# Altium schematic sheet TestingChargeController.SchDoc: HIGH VOLTAGE BUCK/BOOST MULTI-CHEMISTRY BATTERY CHARGER
size 513 x 386 mm; Date: 09-07-21; SheetNumber: 7; SheetTotal: 8; SKU#(-P): DCXXXXA-P; PCA BOM(-I): 700-DCXXXXA-I_REV01; SKU#(-D): DCXXXXA-D; SKU#(-Q): DCXXXXA-Q; SKU#(-V): DCXXXXA-V; SKU#(-F): DCXXXXA-F; SKU#(-O): DCXXXXA-O; PCA BOM(-K): 700-DCXXXXA-K_REV01; SKU#(-M): DCXXXXA-M; PCA BOM(-Y): 700-DCXXXXA-Y_REV01; PCA BOM(-Z): 700-DCXXXXA-Z_REV01; SKU#(-Y): DCXXXXA-Y; PCA BOM: 700-DC2044B_REV01; RevCode: 01; PCA BOM(-E): 700-DCXXXXA-E_REV01; SKU#: DC2044B; PCA BOM(-S): 700-DCXXXXA-S_REV01; Page Number: 1; SKU#(-E): DCXXXXA-E; SKU#(-X): DCXXXXA-X; Page Count: 1; SKU#(-G): DCXXXXA-G; PCA BOM(-W): 700-DCXXXXA-W_REV01; SKU#(-T): DCXXXXA-T; PCA BOM(-T): 700-DCXXXXA-L_REV01; SIZE: N/A; SKU#(-H): DCXXXXA-H; PCA BOM(-N): 700-DCXXXXA-N_REV01; SKU#(-K): DCXXXXA-K; SKU#(-L): DCXXXXA-L; PCA BOM(-U): 700-DCXXXXA-U_REV01; PCA BOM(-O): 700-DCXXXXA-O_REV01; IC NO.: LTC4020; SKU#(-W): DCXXXXA-W; SKU#(-R): DCXXXXA-R; PCA BOM(-Q): 700-DCXXXXA-Q_REV01; PCA BOM(-M): 700-DCXXXXA-M_REV01; SKU#(-I): DCXXXXA-I; PCA BOM(-L): 700-DCXXXXA-L_REV01; SKU#(-N): DCXXXXA-N; PCA BOM(-X): 700-DCXXXXA-X_REV01; PCA BOM(-F): 700-DCXXXXA-F_REV01; PCA BOM(-G): 700-DCXXXXA-G_REV01; PCA BOM(-V): 700-DCXXXXA-V_REV01; PCA BOM(-P): 700-DCXXXXA-P_REV01; SKU#(-Z): DCXXXXA-Z; PCA SCHEMATIC: 710-DC2044B_REV01; PCA BOM(-R): 700-DCXXXXA-R_REV01; SKU#(-J): DCXXXXA-J; PCA BOM(-J): 700-DCXXXXA-J_REV01; PCA BOM(-D): 700-DCXXXXA-D_REV01; PCB DESIGNER: NC; Variant Name: <Variant Name>; PCA ASS'Y DWG: 705-DC2044B_REV01; APP. ENG.: WAT; PCA BOM(-H): 700-DCXXXXA-H_REV01; SKU#(-S): DCXXXXA-S; SKU#(-U): DCXXXXA-U; DsnPath: C:\Users\temp\Documents\WPI\MQP\dc2044b\710-DC2044B_REV01_PCA_SCHEMATIC.DSN; SchematicName: SCHEMATIC1; PageName: PAGE1; PageSize: C; TopSchematic: True
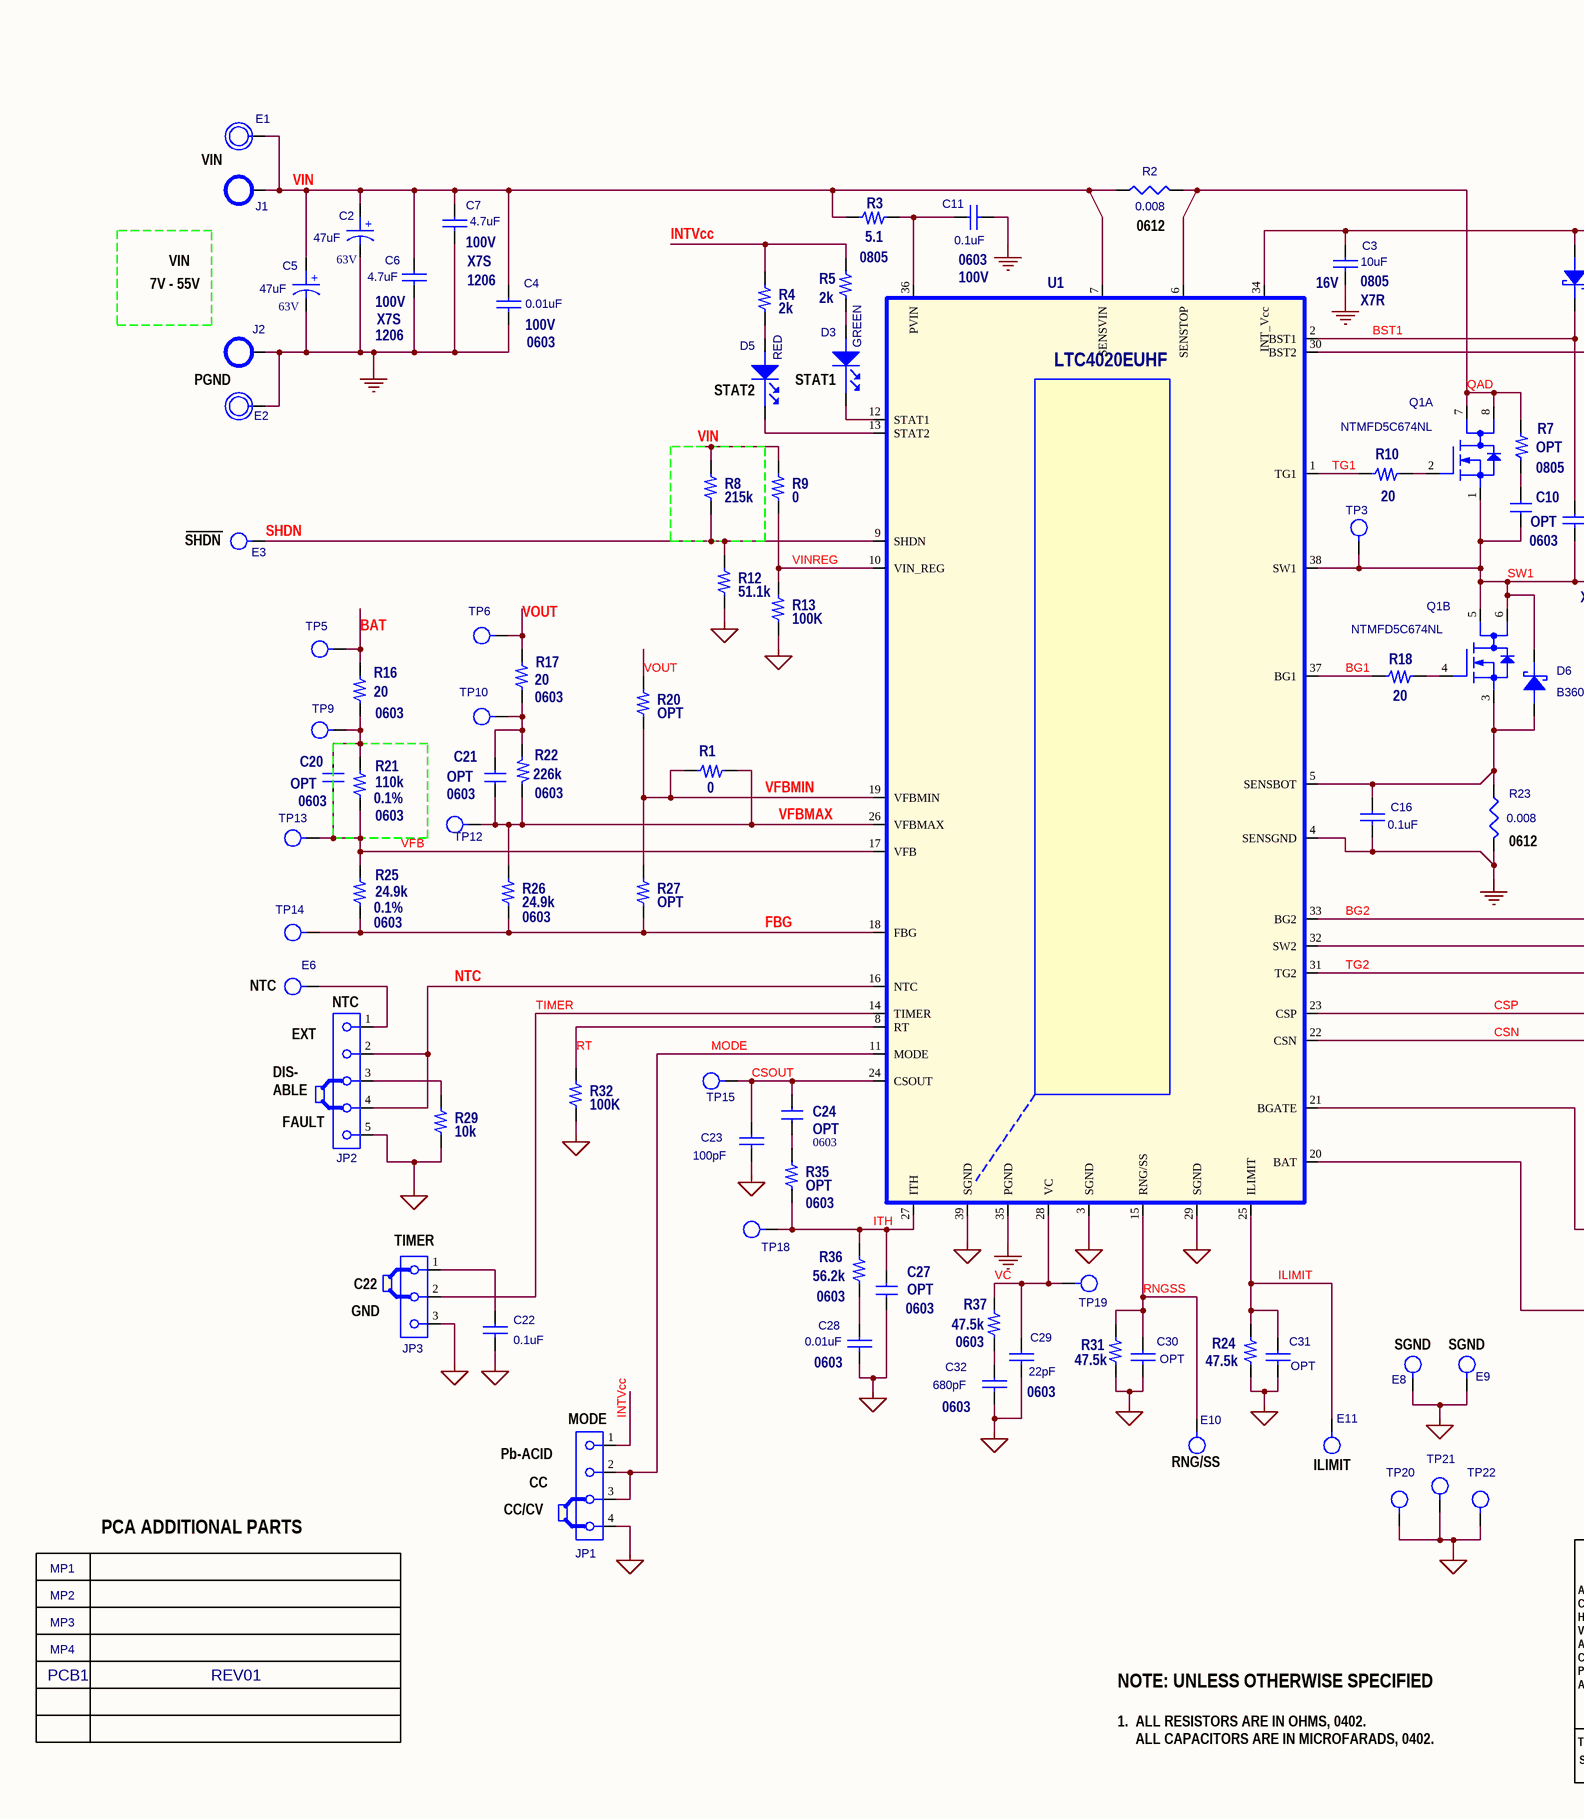
[diagram p0: TestingChargeController.SchDoc, left]
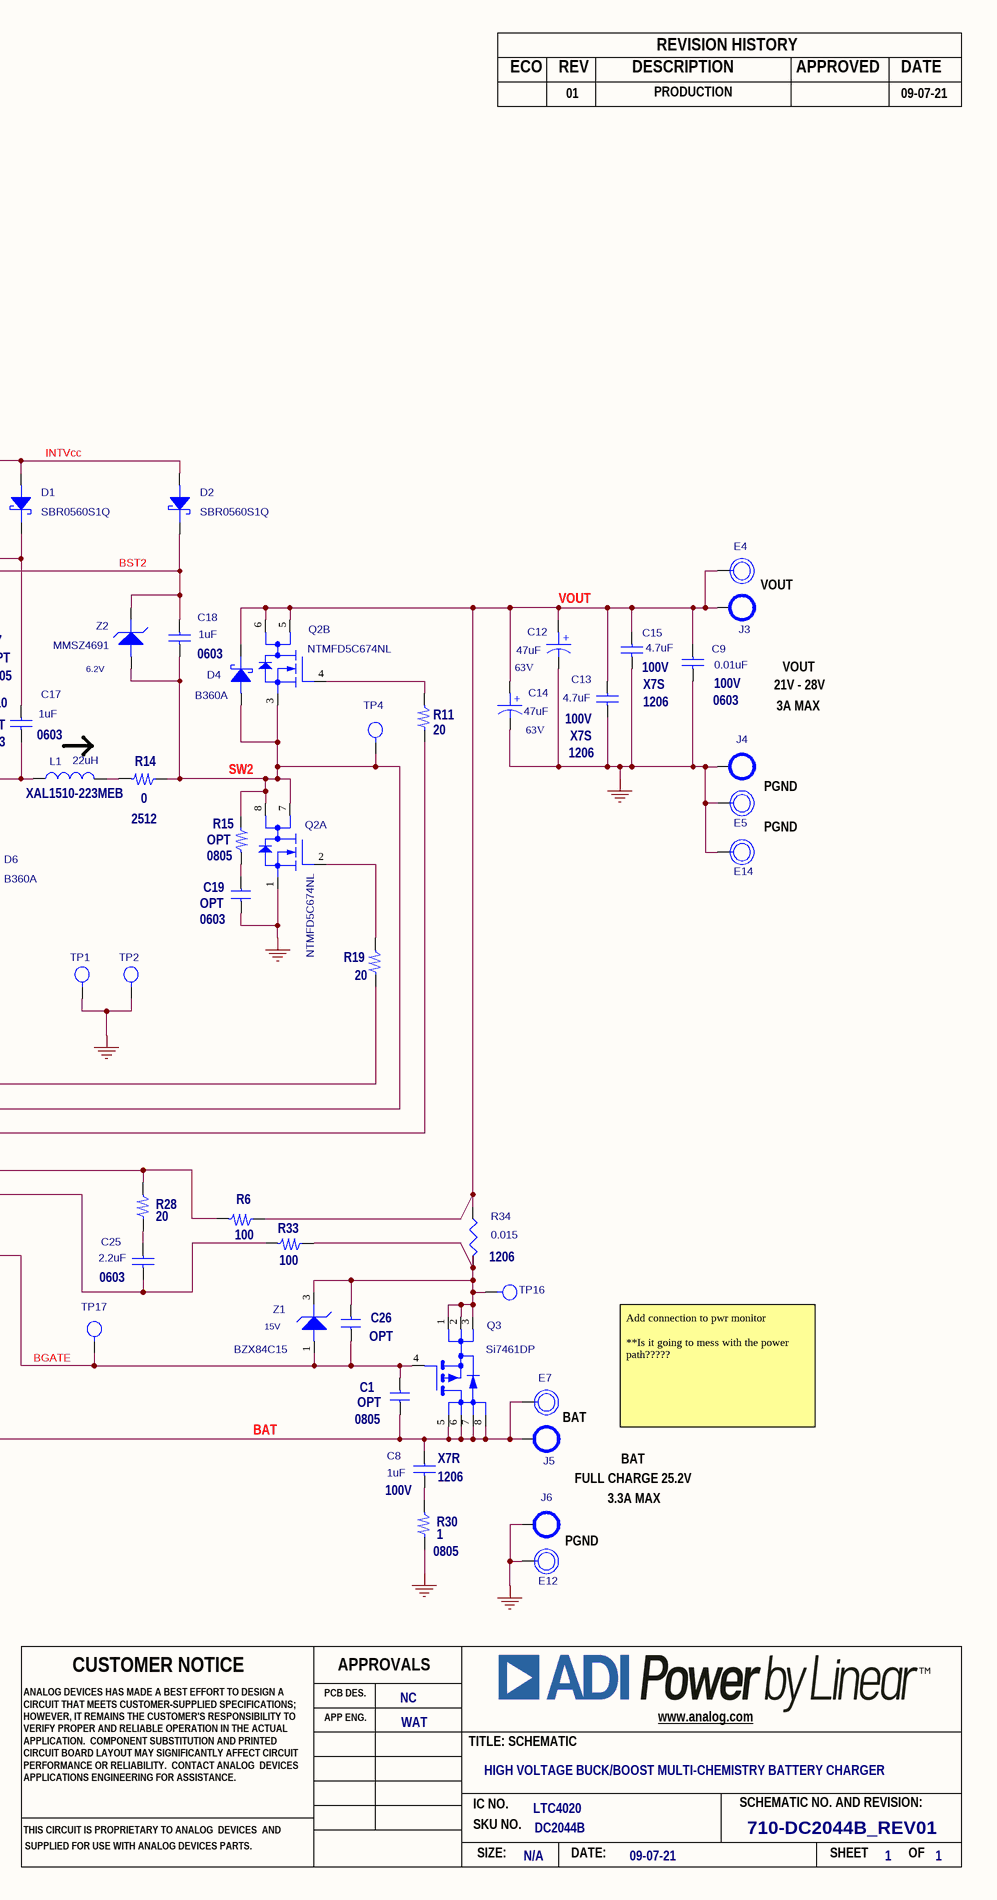
[diagram p1: TestingChargeController.SchDoc, right]

## Parts
*  SKU#: DC2044B  Page Number: 1  PCB DESIGNER: NC  PCA SCHEMATIC: 710-DC2044B_REV01  IC NO.: LTC4020  DATE: 09-07-21  APP. ENG.: WAT  Title: HIGH VOLTAGE BUCK/BOOST MULTI-CHEMISTRY BATTERY CHARGER  (graphical)
C1  OPT  Package Size: 0805  [CC0805N]
C2  47uF  Rated Voltage: 63V  [PANASONIC_ZA_8X10.2]
C3  10uF  Rated Voltage: 16V  Dielectric Type: X7R  Package Size: 0805  [CC0805N]
C4  0.01uF  Rated Voltage: 100V  Package Size: 0603  [CC0603N]
C5  47uF  Rated Voltage: 63V  [PANASONIC_ZA_8X10.2]
C6  4.7uF  Package Size: 1206  Dielectric Type: X7S  Rated Voltage: 100V  [CC1206N]
C7  4.7uF  Package Size: 1206  Dielectric Type: X7S  Rated Voltage: 100V  [CC1206N]
C8  1uF  Rated Voltage: 100V  Temperature Coefficient: X7R  Package Size: 1206  [CC1206N]
C9  0.01uF  Rated Voltage: 100V  Package Size: 0603  [CC0603N]
C10  OPT  Package Size: 0603  [CC0603N]
C11  0.1uF  Rated Voltage: 100V  Package Size: 0603  [CC0603N]
C12  47uF  Rated Voltage: 63V  [PANASONIC_ZA_8X10.2]
C13  4.7uF  Rated Voltage: 100V  Dielectric Type: X7S  Package Size: 1206  [CC1206N]
C14  47uF  Rated Voltage: 63V  [PANASONIC_ZA_8X10.2]
C15  4.7uF  Package Size: 1206  Dielectric Type: X7S  Rated Voltage: 100V  [CC1206N]
C16  0.1uF  [CC0402N]
C17  1uF  Package Size: 0603  [CC0603N]
C18  1uF  Package Size: 0603  [CC0603N]
C19  OPT  Package Size: 0603  [CC0603N]
C20  OPT  Package Size: 0603  [CC0603N]
C21  OPT  Package Size: 0603  [CC0603N]
C22  0.1uF  [CC0402N]
C23  100pF  [CC0402N]
C24  OPT  Package Size: 0603  [CC0603N]
C25  2.2uF  Package Size: 0603  [CC0603N]
C26  OPT  [CC0603N]
C27  OPT  Package Size: 0603  [CC0603N]
C28  0.01uF  Package Size: 0603  [CC0603N]
C29  22pF  Package Size: 0603  [CC0603N]
C30  OPT  [CC0402N]
C31  OPT  [CC0402N]
C32  680pF  Package Size: 0603  [CC0603N]
D1  SBR0560S1Q  [SOD-123N]
D2  SBR0560S1Q  [SOD-123N]
D3  GREEN  [LED_0603]
D4  B360A  [SMA-N]
D5  RED  [LED_0603]
D6  B360A  [SMA-N]
E1  TEST POINT  [MILLMAX2501]  (value not drawn)
E2  TEST POINT  [MILLMAX2501]  (value not drawn)
E3  TEST POINT  [MILLMAX2308]  (value not drawn)
E4  TEST POINT  [MILLMAX2501]  (value not drawn)
E5  TEST POINT  [MILLMAX2501]  (value not drawn)
E6  TEST POINT  [MILLMAX2308]  (value not drawn)
E7  TEST POINT  [MILLMAX2501]  (value not drawn)
E8  TEST POINT  [MILLMAX2308]  (value not drawn)
E9  TEST POINT  [MILLMAX2308]  (value not drawn)
E10  TEST POINT  [MILLMAX2308]  (value not drawn)
E11  TEST POINT  [MILLMAX2308]  (value not drawn)
E12  TEST POINT  [MILLMAX2501]  (value not drawn)
E14  TEST POINT  [MILLMAX2501]  (value not drawn)
J1  BANANA JACK  [KEY-575-4]  (value not drawn)
J2  BANANA JACK  [KEY-575-4]  (value not drawn)
J3  BANANA JACK  [KEY-575-4]  (value not drawn)
J4  BANANA JACK  [KEY-575-4]  (value not drawn)
J5  BANANA JACK  [KEY-575-4]  (value not drawn)
J6  BANANA JACK  [KEY-575-4]  (value not drawn)
JP1  HDR  [HD1X4-079]  (value not drawn)
JP2  HEADER  [HD1X5-079]  (value not drawn)
JP3  HDR  [HD1X3-079]  (value not drawn)
L1  22uH  Manufacturer PN: XAL1510-223MEB  [COILCRAFT-XAL1510]
MP1  STANDOFF  [MTG-8831]  (value not drawn)
MP2  STANDOFF  [MTG-8831]  (value not drawn)
MP3  STANDOFF  [MTG-8831]  (value not drawn)
MP4  STANDOFF  [MTG-8831]  (value not drawn)
PCB1  BOM Notes: REV01  (hidden comment: PCB, DC2044B)
Q1  NTMFD5C674NL  [ONSEMI-DFN8-SO-8FL]  (parts A,B of 2)
Q2  NTMFD5C674NL  [ONSEMI-DFN8-SO-8FL]  (parts A,B of 2)
Q3  Si7461DP  [VISHAY_PPAK_SO-8]
R1  0  [CR0402N]
R2  0.008  [SUSUMU-PRL1632]
R3  5.1  Package Size: 0805  [CR0805N]
R4  2k  [CR0402N]
R5  2k  [CR0402N]
R6  100  [CR0402N]
R7  OPT  Package Size: 0805  [CR0805M]
R8  215k  [CR0402N]
R9  0  [CR0402N]
R10  20  [CR0402N]
R11  20  [CR0402N]
R12  51.1k  [CR0402N]
R13  100K  [CR0402N]
R14  0  Package Size: 2512  [VISHAY-WSL_9-2512]
R15  OPT  Package Size: 0805  [CR0805M]
R16  20  Package Size: 0603  [CR0603N]
R17  20  Package Size: 0603  [CR0603N]
R18  20  [CR0402N]
R19  20  [CR0402N]
R20  OPT  [CR0402N]
R21  110k  Package Size: 0603  Tolerance: 0.1%  [CR0603N]
R22  226k  Package Size: 0603  [CR0603N]
R23  0.008  [SUSUMU-PRL1632]
R24  47.5k  [CR0402N]
R25  24.9k  Package Size: 0603  Tolerance: 0.1%  [CR0603N]
R26  24.9k  Package Size: 0603  [CR0603N]
R27  OPT  [CR0402N]
R28  20  [CR0402N]
R29  10k  [CR0402N]
R30  1  Package Size: 0805  [CR0805M]
R31  47.5k  [CR0402N]
R32  100K  [CR0402N]
R33  100  [CR0402N]
R34  0.015  Package Size: 1206  [SUSUMU-KRL1632]
R35  OPT  Package Size: 0603  [CR0603N]
R36  56.2k  Package Size: 0603  [CR0603N]
R37  47.5k  Package Size: 0603  [CR0603N]
TP1  TEST PAD  [PADSTYLE1]  (value not drawn)
TP2  TEST PAD  [PADSTYLE1]  (value not drawn)
TP3  TEST PAD  [PADSTYLE1]  (value not drawn)
TP4  TEST PAD  [PADSTYLE1]  (value not drawn)
TP5  TEST PAD  [PADSTYLE1]  (value not drawn)
TP6  TEST PAD  [PADSTYLE1]  (value not drawn)
TP9  TEST PAD  [PADSTYLE1]  (value not drawn)
TP10  TEST PAD  [PADSTYLE1]  (value not drawn)
TP12  TEST PAD  [PADSTYLE1]  (value not drawn)
TP13  TEST PAD  [PADSTYLE1]  (value not drawn)
TP14  TEST PAD  [PADSTYLE1]  (value not drawn)
TP15  TEST PAD  [PADSTYLE1]  (value not drawn)
TP16  TEST PAD  [PADSTYLE1]  (value not drawn)
TP17  TEST PAD  [PADSTYLE1]  (value not drawn)
TP18  TEST PAD  [PADSTYLE1]  (value not drawn)
TP19  TEST PAD  [PADSTYLE1]  (value not drawn)
TP20  TEST PAD  [PADSTYLE1]  (value not drawn)
TP21  TEST PAD  [PADSTYLE1]  (value not drawn)
TP22  TEST PAD  [PADSTYLE1]  (value not drawn)
U1  LTC4020EUHF  [LTC-QFN-38-1701]
XJP1  SHUNT  [SAMTEC-SHUNT-079]  (value not drawn)
XJP2  SHUNT  [SAMTEC-SHUNT-079]  (value not drawn)
XJP3  SHUNT  [SAMTEC-SHUNT-079]  (value not drawn)
Z1  BZX84C15  Rated Voltage or Zener Voltage: 15V  [SOT23-3N]
Z2  MMSZ4691  Rated Voltage or Zener Voltage: 6.2V  [SOD-123N]

## Nets
GND_POWER: C2.2 C3.2 C4.2 C5.2 C6.2 C7.2 C9.2 C11.2 C12.2 C13.2 C14.2 C15.2 C16.2 C19.1 E2.1 E5.1 E12.1 E14.1 J2.1 J4.1 J6.1 Q2.1(S1) R23.2 R30.2 TP1.1 TP2.1 U1.4(SENSGND) U1.35(PGND)
GND_SIGNAL: C22.2 C23.2 C27.2 C28.2 C29.2 C30.2 C31.2 C32.2 E8.1(A) E9.1(A) JP1.4 JP2.5 JP3.3 R12.2 R13.2 R24.2 R29.2 R31.2 R32.2 TP20.1 TP21.1 TP22.1 U1.3(SGND) U1.29(SGND) U1.39(SGND)
BAT: C1.2 C8.1 E7.1 J5.1 Q3.5(D_5) Q3.6(D_6) Q3.7(D_7) Q3.8(D_8) R16.1 TP5.1 U1.20(BAT)
BG1: R18.1 U1.37(BG1)
BG2: R19.2 U1.33(BG2)
BGATE: C1.1 C26.2 Q3.4(G) TP17.1 U1.21(BGATE) Z1.1(A)
BST1: C17.1 D1.1(C) U1.2(BST1)
BST2: C18.1 D2.1(C) U1.30(BST2) Z2.1(C)
CSN: C25.2 R33.1 U1.22(CSN)
CSOUT: C23.1 C24.1 TP15.1 U1.24(CSOUT)
CSP: R6.1 R28.1 U1.23(CSP)
FBG: R25.2 R26.2 R27.2 TP14.1 U1.18(FBG)
ILIMIT: C31.1 E11.1(A) R24.1 U1.25(ILIMIT)
INTVcc: C3.1 D1.2(A) D2.2(A) JP1.1 R4.1 R5.1 U1.34(INT_Vcc)
ITH: C27.1 R35.2 R36.1 TP18.1 U1.27(ITH)
MODE: JP1.2 JP1.3 U1.11(MODE)
NTC: JP2.2 JP2.4 U1.16(NTC)
QAD: Q1.7(D1_7) Q1.8(D1_8) R2.2 R7.2 U1.6(SENSTOP)
RNGSS: C30.1 E10.1(A) R31.1 U1.15(RNG/SS)
RT: R32.1 U1.8(RT)
SHDN: E3.1(A) R8.2 R12.1 U1.9(SHDN)
SW1: C10.1 C17.2 D6.1(C) L1.1 Q1.1(S1) Q1.5(D2_5) Q1.6(D2_6) TP3.1 U1.38(SW1)
SW2: C18.2 D4.2(A) Q2.3(S2) Q2.7(D1_7) Q2.8(D1_8) R14.2 R15.2 TP4.1 U1.32(SW2) Z2.2(A)
TG1: R10.1 U1.1(TG1)
TG2: R11.2 U1.31(TG2)
TIMER: JP3.2 U1.14(TIMER)
VC: C29.1 R37.1 TP19.1 U1.28(VC)
VFB: C20.2 R21.2 R25.1 TP13.1 U1.17(VFB)
VFBMAX: C21.2 R1.2 R22.2 R26.1 TP12.1 U1.26(VFBMAX)
VFBMIN: R1.1 R20.2 R27.1 U1.19(VFBMIN)
VIN: C2.1 C4.1 C5.1 C6.1 C7.1 E1.1 J1.1 R2.1 R3.1 R8.1 R9.1 U1.7(SENSVIN)
VINREG: R9.2 R13.1 U1.10(VIN_REG)
VOUT: C9.1 C12.1 C13.1 C14.1 C15.1 D4.1(C) E4.1 J3.1 Q2.5(D2_5) Q2.6(D2_6) R6.2 R17.1 R20.1 R34.1 TP6.1
NetC8_2: C8.2 R30.1
NetC10_2: C10.2 R7.1
NetC11_1: C11.1 R3.2 U1.36(PVIN)
NetC16_1: C16.1 D6.2(A) Q1.3(S2) R23.1 U1.5(SENSBOT)
NetC19_2: C19.2 R15.1
NetC20_1: C20.1 R16.2 R21.1 TP9.1
NetC21_1: C21.1 R17.2 R22.1 TP10.1
NetC22_1: C22.1 JP3.1
NetC24_2: C24.2 R35.1
NetC25_1: C25.1 R28.2
NetC26_1: C26.1 Q3.1(S_1) Q3.2(S_2) Q3.3(S_3) R33.2 R34.2 TP16.1 Z1.3(C)
NetC28_1: C28.1 R36.2
NetC32_1: C32.1 R37.2
NetD3_1: D3.1(CATHODE) U1.12(STAT1)
NetD3_2: D3.2(ANODE) R5.2
NetD5_1: D5.1(CATHODE) U1.13(STAT2)
NetD5_2: D5.2(ANODE) R4.2
NetE6_1: E6.1(A) JP2.1
NetJP2_3: JP2.3 R29.1
NetL1_2: L1.2 R14.1
NetQ1_2: Q1.2(G1) R10.2
NetQ1_4: Q1.4(G2) R18.2
NetQ2_2: Q2.2(G1) R19.1
NetQ2_4: Q2.4(G2) R11.1

## Notes on the sheet
- REVISION HISTORY
- ECO
- REV
- 01
- DESCRIPTION
- PRODUCTION
- APPROVED
- DATE
- 09-07-21
- VIN
- (near R2) 0612
- 7V - 55V
- PGND
- (near D5) STAT2
- (near D3) STAT1
- VOUT
- 21V - 28V
- 3A MAX
- (near E3) SHDN
- (near R23) 0612
- (near E6) NTC
- NTC
- (near XJP2) EXT
- (near XJP2) DIS-
  ABLE
- FAULT
- TIMER
- GND
- (near XJP3) C22
- (near E8) SGND
- (near E9) SGND
- BAT
- Add connection to pwr monitor
  **Is it going to mess with the power path?????
- FULL CHARGE 25.2V
- 3.3A MAX
- (near XJP1) Pb-ACID
- (near JP1) MODE
- (near E10) RNG/SS
- (near E11) ILIMIT
- PCA ADDITIONAL PARTS
- (near XJP1) CC/CV
- (near XJP1) CC
- NOTE: UNLESS OTHERWISE SPECIFIED
- 1.  ALL RESISTORS ARE IN OHMS, 0402.
  ALL CAPACITORS ARE IN MICROFARADS, 0402.
- (in symbol CAP_P_ALT) +
- (in symbol TITLEBLK_REV09_2) CUSTOMER NOTICE; APPROVALS; PCB DES.; APP ENG.; www.analog.com; TITLE: SCHEMATIC; ANALOG DEVICES HAS MADE A BEST EFFORT TO DESIGN A / CIRCUIT THAT MEETS CUSTOMER-SUPPLIED SPECIFICATIONS; / HOWEVER, IT REMAINS THE CUSTOMER'S RESPONSIBILITY TO / VERIFY PROPER AND RELIABLE OPERATION IN THE ACTUAL / APPLICATION.  COMPONENT SUBSTITUTION AND PRINTED / CIRCUIT BOARD LAYOUT MAY SIGNIFICANTLY AFFECT CIRCUIT / PERFORMANCE OR RELIABILITY.  CONTACT ANALOG  DEVICES / APPLICATIONS ENGINEERING FOR ASSISTANCE.; IC NO.; SCHEMATIC NO. AND REVISION:; THIS CIRCUIT IS PROPRIETARY TO ANALOG  DEVICES  AND; SKU NO.; SUPPLIED FOR USE WITH ANALOG DEVICES PARTS.; SIZE:; DATE:; SHEET; OF

## Library data of the parts
* = TITLEBLK_REV09_2: SKU#(-Z): DCXXXXA-Z; SKU#(-Y): DCXXXXA-Y; SKU#(-X): DCXXXXA-X; SKU#(-W): DCXXXXA-W; SKU#(-V): DCXXXXA-V; SKU#(-U): DCXXXXA-U; SKU#(-T): DCXXXXA-T; SKU#(-S): DCXXXXA-S; SKU#(-R): DCXXXXA-R; SKU#(-Q): DCXXXXA-Q; SKU#(-P): DCXXXXA-P; SKU#(-O): DCXXXXA-O; SKU#(-N): DCXXXXA-N; SKU#(-M): DCXXXXA-M; SKU#(-L): DCXXXXA-L; SKU#(-K): DCXXXXA-K; SKU#(-J): DCXXXXA-J; SKU#(-I): DCXXXXA-I; SKU#(-H): DCXXXXA-H; SKU#(-G): DCXXXXA-G; SKU#(-F): DCXXXXA-F; SKU#(-E): DCXXXXA-E; SKU#(-D): DCXXXXA-D; PCA BOM(-Z): 700-DCXXXXA-Z_REV01; PCA BOM(-Y): 700-DCXXXXA-Y_REV01; PCA BOM(-X): 700-DCXXXXA-X_REV01; PCA BOM(-W): 700-DCXXXXA-W_REV01; PCA BOM(-V): 700-DCXXXXA-V_REV01; PCA BOM(-U): 700-DCXXXXA-U_REV01; PCA BOM(-T): 700-DCXXXXA-L_REV01; PCA BOM(-S): 700-DCXXXXA-S_REV01; PCA BOM(-R): 700-DCXXXXA-R_REV01; PCA BOM(-Q): 700-DCXXXXA-Q_REV01; PCA BOM(-P): 700-DCXXXXA-P_REV01; PCA BOM(-O): 700-DCXXXXA-O_REV01; PCA BOM(-N): 700-DCXXXXA-N_REV01; PCA BOM(-M): 700-DCXXXXA-M_REV01; PCA BOM(-K): 700-DCXXXXA-K_REV01; PCA BOM(-J): 700-DCXXXXA-J_REV01; PCA BOM(-I): 700-DCXXXXA-I_REV01; PCA BOM(-H): 700-DCXXXXA-H_REV01; PCA BOM(-G): 700-DCXXXXA-G_REV01; PCA BOM(-F): 700-DCXXXXA-F_REV01; PCA BOM(-E): 700-DCXXXXA-E_REV01; PCA BOM(-D): 700-DCXXXXA-D_REV01; PCA BOM: 700-DC2044B_REV01; PCA ASS'Y DWG: 705-DC2044B_REV01; RevCode: 01; Variant Name: <Variant Name>; SIZE: N/A; Page Count: 1; PCA BOM(-L): 700-DCXXXXA-L_REV01
C1 = CAP_ALT: CAP., OPTION, 0805; Part Reference: C1; PART_NUMBER: 150-3036; EDMVersionID: 3900555435; CLASS: DISCRETE; Value: OPT; PCB Footprint: CC0805N; Package Type: SMD
C2 = CAP_P_ALT: CAP.,47uF,ALUM ELECT.,63V,20%,SMD,8.0x10.2 mm,AEC-Q200; Part Reference: C2; PART_NUMBER: 150-0969; Manufacturer: PANASONIC; Manufacturer PN: EEHZA1J470P; Inventory Qty: 0; CLASS: DISCRETE; Value: 47uF; PCB Footprint: PANASONIC_ZA_8X10.2; Dielectric Type: ALUM ELECT.; Package Size: SMD,8.0x10.2 mm; Tolerance: 20%
C3 = CAP: CAP.,10uF,X7R,16V,10%,0805; Part Reference: C3; Manufacturer PN: EMK212BB7106MG-T; Manufacturer: TAIYO YUDEN; PART_NUMBER: 150-3231; CLASS: DISCRETE; Inventory Qty: 22441; FPLIST: CC0805N,CC0805L,CC0805M; Value: 10uF; PCB Footprint: CC0805N; Tolerance: 10%; Package Type: SMD
C4 = CAP: CAP.,0.01uF,X7R,100V,10%,0603,AEC-Q200; Part Reference: C4; Manufacturer PN: GCJ188R72A103KA01D; Manufacturer: MURATA; PART_NUMBER: 150-0511; CLASS: DISCRETE; Inventory Qty: 20068; FPLIST: CC0603N,CC0603L,CC0603M; Value: 0.01uF; PCB Footprint: CC0603N; Tolerance: 10%; Dielectric Type: X7R
C5 = CAP_P_ALT: CAP.,47uF,ALUM ELECT.,63V,20%,SMD,8.0x10.2 mm,AEC-Q200; Part Reference: C5; Manufacturer PN: EEHZA1J470P; Manufacturer: PANASONIC; PART_NUMBER: 150-0969; Inventory Qty: 0; CLASS: DISCRETE; Value: 47uF; PCB Footprint: PANASONIC_ZA_8X10.2; Dielectric Type: ALUM ELECT.; Package Size: SMD,8.0x10.2 mm; Tolerance: 20%
C6 = CAP: CAP.,4.7uF,X7S,100V,20%,1206; Part Reference: C6; PART_NUMBER: 150-2278; Manufacturer: AVX; Manufacturer PN: 12061Z475MAT2A; FPLIST: CC1206N,CC1206L,CC1206M; Inventory Qty: 11240; CLASS: DISCRETE; Value: 4.7uF; PCB Footprint: CC1206N; Tolerance: 20%
C7 = CAP: CAP.,4.7uF,X7S,100V,20%,1206; Part Reference: C7; PART_NUMBER: 150-2278; Manufacturer: AVX; Manufacturer PN: 12061Z475MAT2A; FPLIST: CC1206N,CC1206L,CC1206M; Inventory Qty: 11240; CLASS: DISCRETE; Value: 4.7uF; PCB Footprint: CC1206N; Tolerance: 20%
C8 = CAP: CAP.,1uF,X7R,100V,10%,1206,AEC-Q200; Part Reference: C8; Manufacturer PN: CGA5L2X7R2A105K160AA; Manufacturer: TDK; PART_NUMBER: 150-1253; CLASS: DISCRETE; Inventory Qty: 800; FPLIST: CC1206N,CC1206L,CC1206M; Value: 1uF; PCB Footprint: CC1206N; Tolerance: 10%; Dielectric Type: X7R; Package Type: -
C9 = CAP: CAP.,0.01uF,X7R,100V,10%,0603,AEC-Q200; Part Reference: C9; Manufacturer PN: GCJ188R72A103KA01D; Manufacturer: MURATA; PART_NUMBER: 150-0511; CLASS: DISCRETE; Inventory Qty: 20068; FPLIST: CC0603N,CC0603L,CC0603M; Value: 0.01uF; PCB Footprint: CC0603N; Tolerance: 10%; Dielectric Type: X7R
C10 = CAP_ALT: CAP., OPTION, 0603; Part Reference: C10; PART_NUMBER: 150-3038; EDMVersionID: 3900555435; CLASS: DISCRETE; Value: OPT; Package Type: SMD; PCB Footprint: CC0603N
C11 = CAP: CAP.,0.1uF,X7R,100V,10%,0603,AEC-Q200; Part Reference: C11; Manufacturer PN: HMK107B7104KAHT; Manufacturer: TAIYO YUDEN; PART_NUMBER: 150-2623; CLASS: DISCRETE; Inventory Qty: 7960; FPLIST: CC0603N,CC0603L,CC0603M; Value: 0.1uF; PCB Footprint: CC0603N; Tolerance: 10%; Dielectric Type: X7R
C12 = CAP_P_ALT: CAP.,47uF,ALUM ELECT.,63V,20%,SMD,8.0x10.2 mm,AEC-Q200; Part Reference: C12; PART_NUMBER: 150-0969; Manufacturer: PANASONIC; Manufacturer PN: EEHZA1J470P; CLASS: DISCRETE; Inventory Qty: 0; Value: 47uF; PCB Footprint: PANASONIC_ZA_8X10.2; Tolerance: 20%; Package Size: SMD,8.0x10.2 mm; Dielectric Type: ALUM ELECT.
C13 = CAP: CAP.,4.7uF,X7S,100V,20%,1206; Part Reference: C13; Manufacturer PN: 12061Z475MAT2A; Manufacturer: AVX; PART_NUMBER: 150-2278; CLASS: DISCRETE; Inventory Qty: 11240; FPLIST: CC1206N,CC1206L,CC1206M; Value: 4.7uF; PCB Footprint: CC1206N; Tolerance: 20%
C14 = CAP_P_ALT: CAP.,47uF,ALUM ELECT.,63V,20%,SMD,8.0x10.2 mm,AEC-Q200; Part Reference: C14; PART_NUMBER: 150-0969; Manufacturer: PANASONIC; Manufacturer PN: EEHZA1J470P; Inventory Qty: 0; CLASS: DISCRETE; Value: 47uF; PCB Footprint: PANASONIC_ZA_8X10.2; Dielectric Type: ALUM ELECT.; Package Size: SMD,8.0x10.2 mm; Tolerance: 20%
C15 = CAP: CAP.,4.7uF,X7S,100V,20%,1206; Part Reference: C15; PART_NUMBER: 150-2278; Manufacturer: AVX; Manufacturer PN: 12061Z475MAT2A; FPLIST: CC1206N,CC1206L,CC1206M; Inventory Qty: 11240; CLASS: DISCRETE; Value: 4.7uF; PCB Footprint: CC1206N; Tolerance: 20%
C16 = CAP: CAP.,0.1uF,X7R,16V,10%,0402,AEC-Q200; Part Reference: C16; PART_NUMBER: 150-0506; Manufacturer: MURATA; Manufacturer PN: GCM155R71C104KA55D; FPLIST: CC0402N,CC0402L,CC0402M; Inventory Qty: 23025; CLASS: DISCRETE; Value: 0.1uF; PCB Footprint: CC0402N; Package Size: 0402; Dielectric Type: X7R; Tolerance: 10%; Rated Voltage: 16V
C17 = CAP: CAP.,1uF,X7R,16V,10%,0603; Part Reference: C17; Manufacturer PN: C0603C105K4RAC7867; Manufacturer: KEMET; PART_NUMBER: 150-0179; CLASS: DISCRETE; Inventory Qty: 29099; FPLIST: CC0603N,CC0603L,CC0603M; Value: 1uF; PCB Footprint: CC0603N; Rated Voltage: 16V; Tolerance: 10%; Dielectric Type: X7R
C18 = CAP: CAP.,1uF,X7R,16V,10%,0603; Part Reference: C18; Manufacturer PN: C0603C105K4RAC7867; Manufacturer: KEMET; PART_NUMBER: 150-0179; CLASS: DISCRETE; Inventory Qty: 29099; FPLIST: CC0603N,CC0603L,CC0603M; Value: 1uF; PCB Footprint: CC0603N; Rated Voltage: 16V; Tolerance: 10%; Dielectric Type: X7R
C19 = CAP_ALT: CAP., OPTION, 0603; Part Reference: C19; PART_NUMBER: 150-3038; EDMVersionID: 3900555435; CLASS: DISCRETE; Value: OPT; PCB Footprint: CC0603N; Package Type: SMD
C20 = CAP_ALT: CAP., OPTION, 0603; Part Reference: C20; PART_NUMBER: 150-3038; EDMVersionID: 3900555435; CLASS: DISCRETE; Value: OPT; Package Type: SMD; PCB Footprint: CC0603N
C21 = CAP_ALT: CAP., OPTION, 0603; Part Reference: C21; PART_NUMBER: 150-3038; EDMVersionID: 3900555435; CLASS: DISCRETE; Value: OPT; PCB Footprint: CC0603N; Package Type: SMD
C22 = CAP: CAP.,0.1uF,X7R,16V,10%,0402,AEC-Q200; Part Reference: C22; Manufacturer PN: GCM155R71C104KA55D; Manufacturer: MURATA; PART_NUMBER: 150-0506; CLASS: DISCRETE; Inventory Qty: 23025; FPLIST: CC0402N,CC0402L,CC0402M; Value: 0.1uF; Rated Voltage: 16V; Tolerance: 10%; Dielectric Type: X7R; Package Size: 0402; PCB Footprint: CC0402N
C23 = CAP: CAP.,100pF,C0G,50V,5%,0402; Part Reference: C23; PART_NUMBER: 150-0115; Manufacturer: AVX; Manufacturer PN: 04025A101JAT2A; FPLIST: CC0402N,CC0402L,CC0402M; Inventory Qty: 62393; CLASS: DISCRETE; Value: 100pF; PCB Footprint: CC0402N; Package Size: 0402; Dielectric Type: C0G; Tolerance: 5%; Rated Voltage: 50V
C24 = CAP_ALT: CAP., OPTION, 0603; Part Reference: C24; PART_NUMBER: 150-3038; EDMVersionID: 3900555435; CLASS: DISCRETE; Value: OPT; Package Type: SMD; PCB Footprint: CC0603N
C25 = CAP: CAP.,2.2uF,X7R,10V,10%,0603; Part Reference: C25; Manufacturer PN: GRM188R71A225KE15D; Manufacturer: MURATA; PART_NUMBER: 150-2083; CLASS: DISCRETE; Inventory Qty: 13521; FPLIST: CC0603N,CC0603L,CC0603M; Value: 2.2uF; Rated Voltage: 10V; Tolerance: 10%; Dielectric Type: X7R; PCB Footprint: CC0603N
C26 = CAP_ALT: CAP., OPTION, 0603; Part Reference: C26; PART_NUMBER: 150-3038; EDMVersionID: 3900555435; CLASS: DISCRETE; Value: OPT; PCB Footprint: CC0603N; Package Type: SMD; Package Size: 0603
C27 = CAP_ALT: CAP., OPTION, 0603; Part Reference: C27; PART_NUMBER: 150-3038; EDMVersionID: 3900555435; CLASS: DISCRETE; Value: OPT; Package Type: SMD; PCB Footprint: CC0603N
C28 = CAP: CAP.,0.01uF,X7R,50V,10%,0603; Part Reference: C28; Manufacturer PN: 06035C103KAT2A; Manufacturer: AVX; PART_NUMBER: 150-0002; CLASS: DISCRETE; Inventory Qty: 28283; FPLIST: CC0603N,CC0603L,CC0603M; Value: 0.01uF; PCB Footprint: CC0603N; Rated Voltage: 50V; Tolerance: 10%; Dielectric Type: X7R
C29 = CAP: CAP.,22pF,C0G,25V,10%,0603; Part Reference: C29; Manufacturer PN: 06033A220KAT2A; Manufacturer: AVX; PART_NUMBER: 150-3274; CLASS: DISCRETE; Inventory Qty: 12404; FPLIST: CC0603N,CC0603L,CC0603M; Value: 22pF; PCB Footprint: CC0603N; Rated Voltage: 25V; Tolerance: 10%; Dielectric Type: C0G
C30 = CAP: CAP., OPTION, 0402; Part Reference: C30; PART_NUMBER: 150-3148; CLASS: DISCRETE; FPLIST: CC0402N,CC0402L,CC0402M; Value: OPT; PCB Footprint: CC0402N; Package Type: SMD; Package Size: 0402
C31 = CAP: CAP., OPTION, 0402; Part Reference: C31; PART_NUMBER: 150-3148; CLASS: DISCRETE; FPLIST: CC0402N,CC0402L,CC0402M; Value: OPT; PCB Footprint: CC0402N; Package Type: SMD; Package Size: 0402
C32 = CAP: CAP.,680pF,C0G,25V,5%,0603; Part Reference: C32; Manufacturer PN: 06033A681JAT2A; Manufacturer: AVX; PART_NUMBER: 150-0275; CLASS: DISCRETE; Inventory Qty: 8685; FPLIST: CC0603N,CC0603L,CC0603M; Value: 680pF; PCB Footprint: CC0603N; Rated Voltage: 25V; Tolerance: 5%; Dielectric Type: C0G
D1 = DIODE_SCHOTTKY_A_ALT: DIODE,SBR,60V,500mA,SOD123; Part Reference: D1; PART_NUMBER: 210-0561; Manufacturer: DIODES INC.; Manufacturer PN: SBR0560S1Q-7; Inventory Qty: 0; CLASS: DISCRETE; Value: SBR0560S1Q; PCB Footprint: SOD-123N; Package Size: SOD-123; Package Type: SOD123; Rated Voltage or Zener Voltage: 60V
D2 = DIODE_SCHOTTKY_A_ALT: DIODE,SBR,60V,500mA,SOD123; Part Reference: D2; PART_NUMBER: 210-0561; Manufacturer: DIODES INC.; Manufacturer PN: SBR0560S1Q-7; Inventory Qty: 0; CLASS: DISCRETE; Value: SBR0560S1Q; PCB Footprint: SOD-123N; Package Size: SOD-123; Package Type: SOD123; Rated Voltage or Zener Voltage: 60V
D3 = LED_ALT: LED,GREEN,WATER-CLEAR,0603; Part Reference: D3; PART_NUMBER: 270-0051; Manufacturer: LITE-ON; Manufacturer PN: LTST-C190KGKT; CLASS: DISCRETE; Inventory Qty: 49236; Value: GREEN; Package Type: 0603; PCB Footprint: LED_0603
D4 = DIODE_SCHOTTKY_A_ALT: DIODE,SCHOTTKY RECTIFIER,60V,3A,4.6mm X 2.92mm; Part Reference: D4; Manufacturer PN: B360A-13-F; Manufacturer: DIODES INC.; PART_NUMBER: 210-0103; CLASS: DISCRETE; Inventory Qty: 1450; FPLIST: SMA-N,SMA-L,SMA-M,SMA; Value: B360A; PCB Footprint: SMA-N; Max Forward Current or Rated Power: 3A; Rated Voltage or Zener Voltage: 60V; Package Type: 4.6mm X 2.92mm
D5 = LED_ALT: LED,RED,WATER-CLEAR,0603; Part Reference: D5; Manufacturer PN: LTST-C193KRKT-5A; Manufacturer: LITE-ON; PART_NUMBER: 270-0070; CLASS: DISCRETE; Inventory Qty: 15266; Value: RED; Package Type: 0603; Package Size: 0603 (1608 Metric); PCB Footprint: LED_0603
D6 = DIODE_SCHOTTKY_A_ALT: DIODE,SCHOTTKY RECTIFIER,60V,3A,4.6mm X 2.92mm; Part Reference: D6; PART_NUMBER: 210-0103; Manufacturer: DIODES INC.; Manufacturer PN: B360A-13-F; FPLIST: SMA-N,SMA-L,SMA-M,SMA; Inventory Qty: 1450; CLASS: DISCRETE; Value: B360A; PCB Footprint: SMA-N; Package Type: 4.6mm X 2.92mm; Rated Voltage or Zener Voltage: 60V; Max Forward Current or Rated Power: 3A
E1 = TURRET_A: TEST POINT,TURRET,0.094" MTG. HOLE,PCB 0.062" THK; Part Reference: E1; Manufacturer PN: 2501-2-00-80-00-00-07-0; Manufacturer: MILL-MAX; PART_NUMBER: 260-0003; CLASS: IO; Inventory Qty: 823526; Value: TEST POINT; PCB Footprint: MILLMAX2501
E2 = TURRET_A: TEST POINT,TURRET,0.094" MTG. HOLE,PCB 0.062" THK; Part Reference: E2; Manufacturer PN: 2501-2-00-80-00-00-07-0; Manufacturer: MILL-MAX; PART_NUMBER: 260-0003; CLASS: IO; Inventory Qty: 823526; Value: TEST POINT; PCB Footprint: MILLMAX2501
E3 = TEST_POINT_.156_MILL-MAX_2308: TEST POINT,TURRET,0.064" MTG. HOLE,PCB 0.062" THK; Part Reference: E3; PART_NUMBER: 260-0004; Manufacturer PN: 2308-2-00-80-00-00-07-0; Inventory Qty: 1142083; FPLIST: MILLMAX2308,MILLMAX2308-2; CLASS: IO; Value: TEST POINT; Manufacturer: MILL-MAX; PCB Footprint: MILLMAX2308
E4 = TURRET_A: TEST POINT,TURRET,0.094" MTG. HOLE,PCB 0.062" THK; Part Reference: E4; PART_NUMBER: 260-0003; Manufacturer: MILL-MAX; Manufacturer PN: 2501-2-00-80-00-00-07-0; Inventory Qty: 823526; CLASS: IO; Value: TEST POINT; PCB Footprint: MILLMAX2501
E5 = TURRET_A: TEST POINT,TURRET,0.094" MTG. HOLE,PCB 0.062" THK; Part Reference: E5; PART_NUMBER: 260-0003; Manufacturer: MILL-MAX; Manufacturer PN: 2501-2-00-80-00-00-07-0; Inventory Qty: 823526; CLASS: IO; Value: TEST POINT; PCB Footprint: MILLMAX2501
E6 = TEST_POINT_.156_MILL-MAX_2308: TEST POINT,TURRET,0.064" MTG. HOLE,PCB 0.062" THK; Part Reference: E6; PART_NUMBER: 260-0004; Manufacturer PN: 2308-2-00-80-00-00-07-0; Inventory Qty: 1142083; FPLIST: MILLMAX2308,MILLMAX2308-2; CLASS: IO; Value: TEST POINT; PCB Footprint: MILLMAX2308; Manufacturer: MILL-MAX
E7 = TURRET_A: TEST POINT,TURRET,0.094" MTG. HOLE,PCB 0.062" THK; Part Reference: E7; PART_NUMBER: 260-0003; Manufacturer: MILL-MAX; Manufacturer PN: 2501-2-00-80-00-00-07-0; Inventory Qty: 823526; CLASS: IO; Value: TEST POINT; PCB Footprint: MILLMAX2501
E8 = TEST_POINT_.156_MILL-MAX_2308: TEST POINT,TURRET,0.064" MTG. HOLE,PCB 0.062" THK; Part Reference: E8; Manufacturer PN: 2308-2-00-80-00-00-07-0; PART_NUMBER: 260-0004; CLASS: IO; FPLIST: MILLMAX2308,MILLMAX2308-2; Inventory Qty: 1142083; Value: TEST POINT; PCB Footprint: MILLMAX2308; Manufacturer: MILL-MAX
E9 = TEST_POINT_.156_MILL-MAX_2308: TEST POINT,TURRET,0.064" MTG. HOLE,PCB 0.062" THK; Part Reference: E9; PART_NUMBER: 260-0004; Manufacturer PN: 2308-2-00-80-00-00-07-0; Inventory Qty: 1142083; FPLIST: MILLMAX2308,MILLMAX2308-2; CLASS: IO; Value: TEST POINT; PCB Footprint: MILLMAX2308; Manufacturer: MILL-MAX
E10 = TEST_POINT_.156_MILL-MAX_2308: TEST POINT,TURRET,0.064" MTG. HOLE,PCB 0.062" THK; Part Reference: E10; Manufacturer PN: 2308-2-00-80-00-00-07-0; PART_NUMBER: 260-0004; CLASS: IO; FPLIST: MILLMAX2308,MILLMAX2308-2; Inventory Qty: 1142083; Value: TEST POINT; PCB Footprint: MILLMAX2308; Manufacturer: MILL-MAX
E11 = TEST_POINT_.156_MILL-MAX_2308: TEST POINT,TURRET,0.064" MTG. HOLE,PCB 0.062" THK; Part Reference: E11; PART_NUMBER: 260-0004; Manufacturer PN: 2308-2-00-80-00-00-07-0; Inventory Qty: 1142083; FPLIST: MILLMAX2308,MILLMAX2308-2; CLASS: IO; Value: TEST POINT; PCB Footprint: MILLMAX2308; Manufacturer: MILL-MAX
E12 = TURRET_A: TEST POINT,TURRET,0.094" MTG. HOLE,PCB 0.062" THK; Part Reference: E12; Manufacturer PN: 2501-2-00-80-00-00-07-0; Manufacturer: MILL-MAX; PART_NUMBER: 260-0003; CLASS: IO; Inventory Qty: 823526; Value: TEST POINT; PCB Footprint: MILLMAX2501
E14 = TURRET_A: TEST POINT,TURRET,0.094" MTG. HOLE,PCB 0.062" THK; Part Reference: E14; PART_NUMBER: 260-0003; Manufacturer: MILL-MAX; Manufacturer PN: 2501-2-00-80-00-00-07-0; Inventory Qty: 823526; CLASS: IO; Value: TEST POINT; PCB Footprint: MILLMAX2501
J1 = BANANA_KEYSTONE-575-4_C: CONN.,BANANA JACK,FEMALE,THT,NON-INSULATED,SWAGE,0.218"; Part Reference: J1; Manufacturer PN: 575-4; PART_NUMBER: 250-0428; CLASS: IO; Inventory Qty: 203061; Value: BANANA JACK; PCB Footprint: KEY-575-4; Manufacturer: KEYSTONE
J2 = BANANA_KEYSTONE-575-4_C: CONN.,BANANA JACK,FEMALE,THT,NON-INSULATED,SWAGE,0.218"; Part Reference: J2; PART_NUMBER: 250-0428; Manufacturer PN: 575-4; Inventory Qty: 203061; CLASS: IO; Value: BANANA JACK; PCB Footprint: KEY-575-4; Manufacturer: KEYSTONE
J3 = BANANA_KEYSTONE-575-4_C: CONN.,BANANA JACK,FEMALE,THT,NON-INSULATED,SWAGE,0.218"; Part Reference: J3; PART_NUMBER: 250-0428; Manufacturer PN: 575-4; Inventory Qty: 203061; CLASS: IO; Value: BANANA JACK; Manufacturer: KEYSTONE; PCB Footprint: KEY-575-4
J4 = BANANA_KEYSTONE-575-4_C: CONN.,BANANA JACK,FEMALE,THT,NON-INSULATED,SWAGE,0.218"; Part Reference: J4; Manufacturer PN: 575-4; PART_NUMBER: 250-0428; CLASS: IO; Inventory Qty: 203061; Value: BANANA JACK; PCB Footprint: KEY-575-4; Manufacturer: KEYSTONE
J5 = BANANA_KEYSTONE-575-4_C: CONN.,BANANA JACK,FEMALE,THT,NON-INSULATED,SWAGE,0.218"; Part Reference: J5; PART_NUMBER: 250-0428; Manufacturer PN: 575-4; Inventory Qty: 203061; CLASS: IO; Value: BANANA JACK; Manufacturer: KEYSTONE; PCB Footprint: KEY-575-4
J6 = BANANA_KEYSTONE-575-4_C: CONN.,BANANA JACK,FEMALE,THT,NON-INSULATED,SWAGE,0.218"; Part Reference: J6; Manufacturer PN: 575-4; PART_NUMBER: 250-0428; CLASS: IO; Inventory Qty: 203061; Value: BANANA JACK; Manufacturer: KEYSTONE; PCB Footprint: KEY-575-4
JP1 = HDR1X4: CONN.,HDR,MALE,1x4,2mm,VERT,ST,THT; Part Reference: JP1; Manufacturer PN: NRPN041PAEN-RC; Manufacturer: SULLINS CONNECTOR SOLUTIONS; PART_NUMBER: 250-0431; CLASS: IO; Inventory Qty: 11710; PCB Footprint: HD1X4-079
JP2 = HDR1X5: CONN.,HEADER,MALE,1X5,2mm,ST, THT; Part Reference: JP2; Manufacturer PN: NRPN051PAEN-RC; Manufacturer: SULLINS CONNECTOR SOLUTIONS; PART_NUMBER: 250-0564; Inventory Qty: 950; CLASS: IO; PCB Footprint: HD1X5-079
JP3 = 1X3: CONN.,HDR,MALE,1x3,2mm,VERT,ST,THT,NO SUBS. ALLOWED; Part Reference: JP3; Manufacturer PN: TMM-103-02-L-S; Manufacturer: SAMTEC; PART_NUMBER: 250-0638; Inventory Qty: 7904; CLASS: IO; PCB Footprint: HD1X3-079
L1 = IND_ALT: IND.,22uH,PWR,20%,14A,16mOHMS,16.2x15.2mm,AEC-Q200; Part Reference: L1; Manufacturer: COILCRAFT; PART_NUMBER: 200-0363; CLASS: DISCRETE; Inventory Qty: 0; Value: 22uH; PCB Footprint: COILCRAFT-XAL1510; Tolerance: 20%; Package Size: 16.2x15.2mm
MP1 = BLANK_MECHANICAL_PART: STANDOFF,NYLON,SNAP-ON,0.25" (6.4mm); Part Reference: MP1; Manufacturer PN: 8831; Manufacturer: KEYSTONE; PART_NUMBER: 763-0006; Inventory Qty: 227624; CLASS: DISCRETE; Value: STANDOFF; PCB Footprint: MTG-8831
MP2 = BLANK_MECHANICAL_PART: STANDOFF,NYLON,SNAP-ON,0.25" (6.4mm); Part Reference: MP2; Manufacturer PN: 8831; Manufacturer: KEYSTONE; PART_NUMBER: 763-0006; Inventory Qty: 227624; CLASS: DISCRETE; Value: STANDOFF; PCB Footprint: MTG-8831
MP3 = BLANK_MECHANICAL_PART: STANDOFF,NYLON,SNAP-ON,0.25" (6.4mm); Part Reference: MP3; Manufacturer PN: 8831; Manufacturer: KEYSTONE; PART_NUMBER: 763-0006; Inventory Qty: 227624; CLASS: DISCRETE; Value: STANDOFF; PCB Footprint: MTG-8831
MP4 = BLANK_MECHANICAL_PART: STANDOFF,NYLON,SNAP-ON,0.25" (6.4mm); Part Reference: MP4; Manufacturer PN: 8831; Manufacturer: KEYSTONE; PART_NUMBER: 763-0006; Inventory Qty: 227624; CLASS: DISCRETE; Value: STANDOFF; PCB Footprint: MTG-8831
PCB1 = BLANK_PCB_PART: PART_NUMBER: 600-DC2044B; Part Reference: PCB1; Manufacturer: ADI APPROVED SUPPLIER; Inventory Qty: 0; CLASS: DISCRETE; Value: PCB, DC2044B; Manufacturer PN: 600-DC2044B
Q1 = DUAL_8P_N-CH_TYPE1A: XSTR.,MOSFET,DUAL N-CH,60V,42A,DFN-8 (SO8FL); Part Reference: Q1; PART_NUMBER: 240-0596; Manufacturer: ON Semiconductor; Manufacturer PN: NTMFD5C674NLT1G; EDMVersionID: 1895815957; Inventory Qty: 0; CLASS: DISCRETE; Polarity: N-Channel; Value: NTMFD5C674NL; Rated Voltage: 60V; Package Type: DFN-8 (SO8FL); Package Size: DFN-8; PCB Footprint: ONSEMI-DFN8-SO-8FL
Q2 = DUAL_8P_N-CH_TYPE1A: XSTR.,MOSFET,DUAL N-CH,60V,42A,DFN-8 (SO8FL); Part Reference: Q2; PART_NUMBER: 240-0596; Manufacturer: ON Semiconductor; Manufacturer PN: NTMFD5C674NLT1G; EDMVersionID: 1895815957; CLASS: DISCRETE; Polarity: N-Channel; Inventory Qty: 0; Value: NTMFD5C674NL; PCB Footprint: ONSEMI-DFN8-SO-8FL; Package Type: DFN-8 (SO8FL); Package Size: DFN-8; Rated Voltage: 60V
Q3 = 8P_P-CH_TYPE1A: XSTR.,MOSFET, P-CH,60V,8.6A,PowerPAK SO-8; Part Reference: Q3; Manufacturer PN: Si7461DP-T1-GE3; Manufacturer: VISHAY; PART_NUMBER: 240-0180; CLASS: DISCRETE; Inventory Qty: 1926; Value: Si7461DP; PCB Footprint: VISHAY_PPAK_SO-8; Rated Voltage: 60V; Package Type: PowerPAK SO-8
R1 = RES_ALT: RES.,0 OHM,1/16W,0402; Part Reference: R1; PART_NUMBER: 100-0215; Manufacturer: ROHM; Manufacturer PN: MCR01MZPJ000; EDMVersionID: 1192147344; FPLIST: CR0402N,CR0402L,CR0402M; Inventory Qty: 264417; CLASS: DISCRETE; Value: 0; PCB Footprint: CR0402N; Package Size: 0402; Rated Power: 1/16W
R2 = RES: RES.,0.008 OHMS,1%,1W,1206,LONG-SIDE,SENSE; Part Reference: R2; Manufacturer PN: PRL1632-R008-F-T1; Manufacturer: Susumu; PART_NUMBER: 100-1805; Inventory Qty: 0; CLASS: DISCRETE; Temperature Coefficient: 0/ +350ppm; Value: 0.008; Rated Power: 1W; Tolerance: 1%; Package Size: 1206,LONG-SIDE; PCB Footprint: SUSUMU-PRL1632
R3 = RES_ALT: RES.,5.1 OHMS,5%,1/8W,0805,AEC-Q200; Part Reference: R3; PART_NUMBER: 100-2080; Manufacturer: VISHAY; Manufacturer PN: CRCW08055R10JNEA; EDMVersionID: 1192147344; FPLIST: CR0805N,CR0805L,CR0805M; Temperature Coefficient: +/-200PPM; Inventory Qty: 9698; CLASS: DISCRETE; Value: 5.1; Tolerance: 5%; Rated Power: 1/8W; PCB Footprint: CR0805N
R4 = RES_ALT: RES.,2k OHMS,1%,1/16W,0402,AEC-Q200; Part Reference: R4; Manufacturer PN: CRCW04022K00FKED; Manufacturer: VISHAY; PART_NUMBER: 100-0018; EDMVersionID: 1192147344; CLASS: DISCRETE; Inventory Qty: 54049; Temperature Coefficient: 100ppm/C; FPLIST: CR0402N,CR0402L,CR0402M; Value: 2k; PCB Footprint: CR0402N; Rated Power: 1/16W; Tolerance: 1%; Package Size: 0402
R5 = RES_ALT: RES.,2k OHMS,1%,1/16W,0402,AEC-Q200; Part Reference: R5; PART_NUMBER: 100-0018; Manufacturer: VISHAY; Manufacturer PN: CRCW04022K00FKED; EDMVersionID: 1192147344; FPLIST: CR0402N,CR0402L,CR0402M; Temperature Coefficient: 100ppm/C; Inventory Qty: 54049; CLASS: DISCRETE; Value: 2k; PCB Footprint: CR0402N; Package Size: 0402; Tolerance: 1%; Rated Power: 1/16W
R6 = RES_ALT: RES.,100 OHMS,1%,1/16W,0402,AEC-Q200; Part Reference: R6; Manufacturer PN: RK73H1ETTP1000F; Manufacturer: KOA SPEER; PART_NUMBER: 100-0175; EDMVersionID: 1192147344; CLASS: DISCRETE; Inventory Qty: 89473; Temperature Coefficient: 100ppm/C; FPLIST: CR0402N,CR0402L,CR0402M; Value: 100; Rated Power: 1/16W; Tolerance: 1%; Package Size: 0402; PCB Footprint: CR0402N
R7 = RES_ALT: RES., OPTION, 0805; Part Reference: R7; PART_NUMBER: 100-2558; EDMVersionID: 1192147344; CLASS: DISCRETE; Value: OPT; PCB Footprint: CR0805M
R8 = RES_ALT: RES.,215k OHMS,1%,1/16W,0402,AEC-Q200; Part Reference: R8; Manufacturer PN: NRC04F5113TRF; Manufacturer: NIC; PART_NUMBER: 100-0583; EDMVersionID: 1192147344; CLASS: DISCRETE; Inventory Qty: 20064; Temperature Coefficient: +/-100PPM; FPLIST: CR0402N,CR0402L,CR0402M; Value: 215k; PCB Footprint: CR0402N; Rated Power: 1/16W; Tolerance: 1%; Package Size: 0402
R9 = RES_ALT: RES.,0 OHM,1/16W,0402; Part Reference: R9; Manufacturer PN: MCR01MZPJ000; Manufacturer: ROHM; PART_NUMBER: 100-0215; EDMVersionID: 1192147344; CLASS: DISCRETE; Inventory Qty: 264417; FPLIST: CR0402N,CR0402L,CR0402M; Value: 0; PCB Footprint: CR0402N; Rated Power: 1/16W; Package Size: 0402
R10 = RES_ALT: RES.,20 OHMS,1%,1/16W,0402; Part Reference: R10; Manufacturer PN: CRCW040220R0FKED; Manufacturer: VISHAY; PART_NUMBER: 100-2322; EDMVersionID: 1192147344; CLASS: DISCRETE; Inventory Qty: 8000; Temperature Coefficient: 100ppm/C; FPLIST: CR0402N,CR0402L,CR0402M; Value: 20; Rated Power: 1/16W; Tolerance: 1%; Package Size: 0402; PCB Footprint: CR0402N
R11 = RES_ALT: RES.,20 OHMS,1%,1/16W,0402; Part Reference: R11; Manufacturer PN: CRCW040220R0FKED; Manufacturer: VISHAY; PART_NUMBER: 100-2322; EDMVersionID: 1192147344; CLASS: DISCRETE; Inventory Qty: 8000; Temperature Coefficient: 100ppm/C; FPLIST: CR0402N,CR0402L,CR0402M; Value: 20; PCB Footprint: CR0402N; Rated Power: 1/16W; Tolerance: 1%; Package Size: 0402
R12 = RES_ALT: RES.,51.1k OHMS,1%,1/16W,0402,AEC-Q200; Part Reference: R12; Manufacturer PN: RMCF0402FT51K1; Manufacturer: STACKPOLE ELECTRONICS, INC.; PART_NUMBER: 100-2544; EDMVersionID: 1192147344; CLASS: DISCRETE; Inventory Qty: 20000; Temperature Coefficient: 100ppm/C; FPLIST: CR0402N,CR0402L,CR0402M; Value: 51.1k; PCB Footprint: CR0402N; Rated Power: 1/16W; Tolerance: 1%; Package Size: 0402
R13 = RES_ALT: RES.,100k OHMS,1%,1/16W,0402,AEC-Q200; Part Reference: R13; PART_NUMBER: 100-0601; Manufacturer: NIC; Manufacturer PN: NRC04F1003TRF; EDMVersionID: 1192147344; FPLIST: CR0402N,CR0402L,CR0402M; Temperature Coefficient: 100PPM; Inventory Qty: 92256; CLASS: DISCRETE; Value: 100K; PCB Footprint: CR0402N; Package Size: 0402; Tolerance: 1%; Rated Power: 1/16W
R14 = RES_ALT: RES.,0 OHM,200A,2512,COPPER,SENSE; Part Reference: R14; Manufacturer PN: WSL251200000ZEA9; Manufacturer: VISHAY; PART_NUMBER: 100-0588; EDMVersionID: 1192147344; Temperature Coefficient: +/-3900ppm; CLASS: DISCRETE; Inventory Qty: 7479; FPLIST: CR2512N,CR2512L,CR2512M,VISHAY-WSL2512; Value: 0; PCB Footprint: VISHAY-WSL_9-2512; Rated Power: 200A
R15 = RES_ALT: RES., OPTION, 0805; Part Reference: R15; PART_NUMBER: 100-2558; EDMVersionID: 1192147344; CLASS: DISCRETE; Value: OPT; PCB Footprint: CR0805M
R16 = RES_ALT: RES.,20 OHMS,1%,1/10W,0603; Part Reference: R16; PART_NUMBER: 100-0703; Manufacturer: YAGEO; Manufacturer PN: RC0603FR-0720RL; EDMVersionID: 1192147344; FPLIST: CR0603N,CR0603L,CR0603M; Temperature Coefficient: 100PPM; Inventory Qty: 10000; CLASS: DISCRETE; Value: 20; PCB Footprint: CR0603N; Tolerance: 1%; Rated Power: 1/10W
R17 = RES_ALT: RES.,20 OHMS,1%,1/10W,0603; Part Reference: R17; PART_NUMBER: 100-0703; Manufacturer: YAGEO; Manufacturer PN: RC0603FR-0720RL; EDMVersionID: 1192147344; FPLIST: CR0603N,CR0603L,CR0603M; Temperature Coefficient: 100PPM; Inventory Qty: 10000; CLASS: DISCRETE; Value: 20; PCB Footprint: CR0603N; Tolerance: 1%; Rated Power: 1/10W
R18 = RES_ALT: RES.,20 OHMS,1%,1/16W,0402; Part Reference: R18; Manufacturer PN: CRCW040220R0FKED; Manufacturer: VISHAY; PART_NUMBER: 100-2322; EDMVersionID: 1192147344; CLASS: DISCRETE; Inventory Qty: 8000; Temperature Coefficient: 100ppm/C; FPLIST: CR0402N,CR0402L,CR0402M; Value: 20; PCB Footprint: CR0402N; Rated Power: 1/16W; Tolerance: 1%; Package Size: 0402
R19 = RES_ALT: RES.,20 OHMS,1%,1/16W,0402; Part Reference: R19; Manufacturer PN: CRCW040220R0FKED; Manufacturer: VISHAY; PART_NUMBER: 100-2322; EDMVersionID: 1192147344; CLASS: DISCRETE; Inventory Qty: 8000; Temperature Coefficient: 100ppm/C; FPLIST: CR0402N,CR0402L,CR0402M; Value: 20; PCB Footprint: CR0402N; Rated Power: 1/16W; Tolerance: 1%; Package Size: 0402
R20 = RES_ALT: RES., OPTION, 0402; Part Reference: R20; PART_NUMBER: 100-0357; EDMVersionID: 1192147344; CLASS: DISCRETE; Value: OPT; PCB Footprint: CR0402N; Package Size: 0402
R21 = RES_ALT: RES.,110k OHMS,0.1%,1/10W,0603,High Stability; Part Reference: R21; PART_NUMBER: 100-2083; Manufacturer: VISHAY; Manufacturer PN: TNPW0603226KBEEA; EDMVersionID: 1192147344; Inventory Qty: 4724; Temperature Coefficient: +/-25PPM; CLASS: DISCRETE; Value: 110k; PCB Footprint: CR0603N; Rated Power: 1/10W
R22 = RES_ALT: RES.,226k OHMS,1%,1/10W,0603; Part Reference: R22; PART_NUMBER: 100-2671; Manufacturer: NIC; Manufacturer PN: NRC06F2263TRF; EDMVersionID: 1192147344; FPLIST: CR0603N,CR0603L,CR0603M; Temperature Coefficient: 100ppm/C; Inventory Qty: 26500; CLASS: DISCRETE; Value: 226k; PCB Footprint: CR0603N; Tolerance: 1%; Rated Power: 1/10W
R23 = RES: RES.,0.008 OHMS,1%,1W,1206,LONG-SIDE,SENSE; Part Reference: R23; Manufacturer PN: PRL1632-R008-F-T1; Manufacturer: Susumu; PART_NUMBER: 100-1805; Inventory Qty: 0; CLASS: DISCRETE; Temperature Coefficient: 0/ +350ppm; Value: 0.008; PCB Footprint: SUSUMU-PRL1632; Rated Power: 1W; Tolerance: 1%; Package Size: 1206,LONG-SIDE
R24 = RES_ALT: RES.,47.5k OHMS,1%,1/16W,0402; Part Reference: R24; PART_NUMBER: 100-0390; Manufacturer: NIC; Manufacturer PN: NRC04F4752TRF; EDMVersionID: 1192147344; FPLIST: CR0402N,CR0402L,CR0402M; Temperature Coefficient: 100ppm/C; Inventory Qty: 10000; CLASS: DISCRETE; Value: 47.5k; PCB Footprint: CR0402N; Package Size: 0402; Tolerance: 1%; Rated Power: 1/16W
R25 = RES_ALT: RES.,24.9k OHMS,0.1%,1/8W,0603,AEC-Q00; Part Reference: R25; PART_NUMBER: 100-1806; Manufacturer: VISHAY; Manufacturer PN: TNPW060324K9BEEA; EDMVersionID: 1192147344; Inventory Qty: 0; Temperature Coefficient: +/-25ppm; CLASS: DISCRETE; Value: 24.9k; PCB Footprint: CR0603N; Rated Power: 1/8W
R26 = RES_ALT: RES.,24.9k OHMS,1%,1/10W,0603,AEC-Q200; Part Reference: R26; PART_NUMBER: 100-0037; Manufacturer: NIC; Manufacturer PN: NRC06F2492TRF; EDMVersionID: 1192147344; FPLIST: CR0603N,CR0603L,CR0603M; Temperature Coefficient: 100ppm/C; Inventory Qty: 22314; CLASS: DISCRETE; Value: 24.9k; PCB Footprint: CR0603N; Tolerance: 1%; Rated Power: 1/10W
R27 = RES_ALT: RES., OPTION, 0402; Part Reference: R27; PART_NUMBER: 100-0357; EDMVersionID: 1192147344; CLASS: DISCRETE; Value: OPT; PCB Footprint: CR0402N; Package Size: 0402
R28 = RES_ALT: RES.,20 OHMS,1%,1/16W,0402,AEC-Q200; Part Reference: R28; Manufacturer PN: NRC04F20R0TRF; Manufacturer: NIC; PART_NUMBER: 100-0250; EDMVersionID: 1192147344; CLASS: DISCRETE; Inventory Qty: 29845; Temperature Coefficient: 100ppm; FPLIST: CR0402N,CR0402L,CR0402M; Value: 20; PCB Footprint: CR0402N; Rated Power: 1/16W; Tolerance: 1%; Package Size: 0402
R29 = RES_ALT: RES.,10k OHMS,1%,1/10W,0402,AEC-Q200; Part Reference: R29; Manufacturer PN: RK73H1ETTP1002F; Manufacturer: KOA SPEER; PART_NUMBER: 100-0724; EDMVersionID: 1192147344; CLASS: DISCRETE; Inventory Qty: 88953; Temperature Coefficient: 100ppm; FPLIST: CR0402N,CR0402L,CR0402M; Value: 10k; PCB Footprint: CR0402N; Rated Power: 1/10W; Tolerance: 1%; Package Size: 0402
R30 = RES_ALT: RES.,1 OHM,1%,1/8W,0805,AEC-Q200; Part Reference: R30; Manufacturer PN: CRCW08051R00FKEA; Manufacturer: VISHAY; PART_NUMBER: 100-0932; EDMVersionID: 1192147344; CLASS: DISCRETE; Inventory Qty: 5000; Temperature Coefficient: +/-100PPM; FPLIST: CR0805N,CR0805L,CR0805M; Value: 1; PCB Footprint: CR0805M; Rated Power: 1/8W; Tolerance: 1%
R31 = RES_ALT: RES.,47.5k OHMS,1%,1/16W,0402; Part Reference: R31; Manufacturer PN: NRC04F4752TRF; Manufacturer: NIC; PART_NUMBER: 100-0390; EDMVersionID: 1192147344; CLASS: DISCRETE; Inventory Qty: 10000; Temperature Coefficient: 100ppm/C; FPLIST: CR0402N,CR0402L,CR0402M; Value: 47.5k; PCB Footprint: CR0402N; Rated Power: 1/16W; Tolerance: 1%; Package Size: 0402
R32 = RES_ALT: RES.,100k OHMS,1%,1/16W,0402,AEC-Q200; Part Reference: R32; PART_NUMBER: 100-0601; Manufacturer: NIC; Manufacturer PN: NRC04F1003TRF; EDMVersionID: 1192147344; FPLIST: CR0402N,CR0402L,CR0402M; Temperature Coefficient: 100PPM; Inventory Qty: 92256; CLASS: DISCRETE; Value: 100K; PCB Footprint: CR0402N; Package Size: 0402; Tolerance: 1%; Rated Power: 1/16W
R33 = RES_ALT: RES.,100 OHMS,1%,1/16W,0402,AEC-Q200; Part Reference: R33; Manufacturer PN: RK73H1ETTP1000F; Manufacturer: KOA SPEER; PART_NUMBER: 100-0175; EDMVersionID: 1192147344; CLASS: DISCRETE; Inventory Qty: 89473; Temperature Coefficient: 100ppm/C; FPLIST: CR0402N,CR0402L,CR0402M; Value: 100; PCB Footprint: CR0402N; Rated Power: 1/16W; Tolerance: 1%; Package Size: 0402
R34 = RES: RES.,0.015 OHMS,1%,3/4W,1206,AEC-Q200,METAL,SENSE; Part Reference: R34; Manufacturer PN: KRL1632E-C-R015-F-T1; Manufacturer: SUSUMU; PART_NUMBER: 100-1807; Inventory Qty: 0; CLASS: DISCRETE; Temperature Coefficient: +/-50ppm; Value: 0.015; Rated Power: 3/4W; Tolerance: 1%; PCB Footprint: SUSUMU-KRL1632
R35 = RES_ALT: RES., OPTION, 0603; Part Reference: R35; PART_NUMBER: 100-2374; EDMVersionID: 1192147344; CLASS: DISCRETE; Value: OPT; PCB Footprint: CR0603N
R36 = RES_ALT: RES.,56.2k OHMS,1%,1/10W,0603,AEC-Q200; Part Reference: R36; Manufacturer PN: NRC06F5622TRF; Manufacturer: NIC; PART_NUMBER: 100-2697; EDMVersionID: 1192147344; CLASS: DISCRETE; Inventory Qty: 50019; Temperature Coefficient: 100ppm/C; FPLIST: CR0603N,CR0603L,CR0603M; Value: 56.2k; Rated Power: 1/10W; Tolerance: 1%; PCB Footprint: CR0603N
R37 = RES_ALT: RES.,47.5k OHMS,1%,1/10W,0603; Part Reference: R37; PART_NUMBER: 100-2554; Manufacturer: VISHAY; Manufacturer PN: CRCW060347K5FKEA; EDMVersionID: 1192147344; FPLIST: CR0603N,CR0603L,CR0603M; Temperature Coefficient: 100ppm/C; Inventory Qty: 67863; CLASS: DISCRETE; Value: 47.5k; PCB Footprint: CR0603N; Tolerance: 1%; Rated Power: 1/10W
TP1 = PAD_STYLE_C: TESTPOINT, PCB COPPER FEATURE; Part Reference: TP1; PART_NUMBER: PCBPADS-8; CLASS: IO; Value: TEST PAD; PCB Footprint: PADSTYLE1
TP2 = PAD_STYLE_C: TESTPOINT, PCB COPPER FEATURE; Part Reference: TP2; PART_NUMBER: PCBPADS-8; CLASS: IO; Value: TEST PAD; PCB Footprint: PADSTYLE1
TP3 = PAD_STYLE_C: TESTPOINT, PCB COPPER FEATURE; Part Reference: TP3; PART_NUMBER: PCBPADS-8; CLASS: IO; Value: TEST PAD; PCB Footprint: PADSTYLE1
TP4 = PAD_STYLE_C: TESTPOINT, PCB COPPER FEATURE; Part Reference: TP4; PART_NUMBER: PCBPADS-8; CLASS: IO; Value: TEST PAD; PCB Footprint: PADSTYLE1
TP5 = PAD_STYLE_C: TESTPOINT, PCB COPPER FEATURE; Part Reference: TP5; PART_NUMBER: PCBPADS-8; CLASS: IO; Value: TEST PAD; PCB Footprint: PADSTYLE1
TP6 = PAD_STYLE_C: TESTPOINT, PCB COPPER FEATURE; Part Reference: TP6; PART_NUMBER: PCBPADS-8; CLASS: IO; Value: TEST PAD; PCB Footprint: PADSTYLE1
TP9 = PAD_STYLE_C: TESTPOINT, PCB COPPER FEATURE; Part Reference: TP9; PART_NUMBER: PCBPADS-8; CLASS: IO; Value: TEST PAD; PCB Footprint: PADSTYLE1
TP10 = PAD_STYLE_C: TESTPOINT, PCB COPPER FEATURE; Part Reference: TP10; PART_NUMBER: PCBPADS-8; CLASS: IO; Value: TEST PAD; PCB Footprint: PADSTYLE1
TP12 = PAD_STYLE_C: TESTPOINT, PCB COPPER FEATURE; Part Reference: TP12; PART_NUMBER: PCBPADS-8; CLASS: IO; Value: TEST PAD; PCB Footprint: PADSTYLE1
TP13 = PAD_STYLE_C: TESTPOINT, PCB COPPER FEATURE; Part Reference: TP13; PART_NUMBER: PCBPADS-8; CLASS: IO; Value: TEST PAD; PCB Footprint: PADSTYLE1
TP14 = PAD_STYLE_C: TESTPOINT, PCB COPPER FEATURE; Part Reference: TP14; PART_NUMBER: PCBPADS-8; CLASS: IO; Value: TEST PAD; PCB Footprint: PADSTYLE1
TP15 = PAD_STYLE_C: TESTPOINT, PCB COPPER FEATURE; Part Reference: TP15; PART_NUMBER: PCBPADS-8; CLASS: IO; Value: TEST PAD; PCB Footprint: PADSTYLE1
TP16 = PAD_STYLE_C: TESTPOINT, PCB COPPER FEATURE; Part Reference: TP16; PART_NUMBER: PCBPADS-8; CLASS: IO; Value: TEST PAD; PCB Footprint: PADSTYLE1
TP17 = PAD_STYLE_C: TESTPOINT, PCB COPPER FEATURE; Part Reference: TP17; PART_NUMBER: PCBPADS-8; CLASS: IO; Value: TEST PAD; PCB Footprint: PADSTYLE1
TP18 = PAD_STYLE_C: TESTPOINT, PCB COPPER FEATURE; Part Reference: TP18; PART_NUMBER: PCBPADS-8; CLASS: IO; Value: TEST PAD; PCB Footprint: PADSTYLE1
TP19 = PAD_STYLE_C: TESTPOINT, PCB COPPER FEATURE; Part Reference: TP19; PART_NUMBER: PCBPADS-8; CLASS: IO; Value: TEST PAD; PCB Footprint: PADSTYLE1
TP20 = PAD_STYLE_C: TESTPOINT, PCB COPPER FEATURE; Part Reference: TP20; PART_NUMBER: PCBPADS-8; CLASS: IO; Value: TEST PAD; PCB Footprint: PADSTYLE1
TP21 = PAD_STYLE_C: TESTPOINT, PCB COPPER FEATURE; Part Reference: TP21; PART_NUMBER: PCBPADS-8; CLASS: IO; Value: TEST PAD; PCB Footprint: PADSTYLE1
TP22 = PAD_STYLE_C: TESTPOINT, PCB COPPER FEATURE; Part Reference: TP22; PART_NUMBER: PCBPADS-8; CLASS: IO; Value: TEST PAD; PCB Footprint: PADSTYLE1
U1 = LTC4020EUHF: IC,55V BUCK-BOOST BATTERY CHARGER,38-pin QFN; Part Reference: U1; Manufacturer PN: LTC4020EUHF#PBF; Manufacturer: LINEAR TECH.; EDMVersionID: 819358601; Inventory Qty: 0; PCB Footprint: LTC-UHF-38-1701; Value: LTC4020EUHF; Package Type: 38-pin QFN; CLASS: IC; Package Size: QFN-38; PART_NUMBER: LTC4020EUHF#PBF
XJP1 = SHUNT_2MM: CONN.,SHUNT,FEMALE,2-POS,2mm; Part Reference: XJP1; PART_NUMBER: 250-0419; Manufacturer: SAMTEC; Manufacturer PN: 2SN-BK-G; CLASS: MECHANICAL; Inventory Qty: 268916; PCB Footprint: SAMTEC-SHUNT-079
XJP2 = SHUNT_2MM: CONN.,SHUNT,FEMALE,2-POS,2mm; Part Reference: XJP2; Manufacturer PN: 2SN-BK-G; Manufacturer: SAMTEC; PART_NUMBER: 250-0419; Inventory Qty: 268916; CLASS: MECHANICAL; PCB Footprint: SAMTEC-SHUNT-079
XJP3 = SHUNT_2MM: CONN.,SHUNT,FEMALE,2-POS,2mm; Part Reference: XJP3; PART_NUMBER: 250-0419; Manufacturer: SAMTEC; Manufacturer PN: 2SN-BK-G; CLASS: MECHANICAL; Inventory Qty: 268916; PCB Footprint: SAMTEC-SHUNT-079
Z1 = ZENER_SOT: DIODE,ZENER,15V,350mW,SOT-23,AEC-Q101; Part Reference: Z1; PART_NUMBER: 210-0510; Manufacturer: NEXPERIA; Manufacturer PN: BZX84-C15,215; FPLIST: SOT23-3N,SOT23-3L,SOT23-3M; Inventory Qty: 0; CLASS: DISCRETE; Value: BZX84C15; Package Type: SOT-23; Max Forward Current or Rated Power: 350mW; PCB Footprint: SOT23-3N
Z2 = ZENER_ALT: DIODE,ZENER,6.2V,500mW,SOD-123,AEC-Q101; Part Reference: Z2; Manufacturer PN: MMSZ4691-E3-08; Manufacturer: VISHAY; PART_NUMBER: 210-0562; Inventory Qty: 0; CLASS: DISCRETE; Value: MMSZ4691; Package Type: SOD-123; Package Size: SOD-123; PCB Footprint: SOD-123N